# Altium project NFC-Reader.PrjPcb (part 11 of 11)
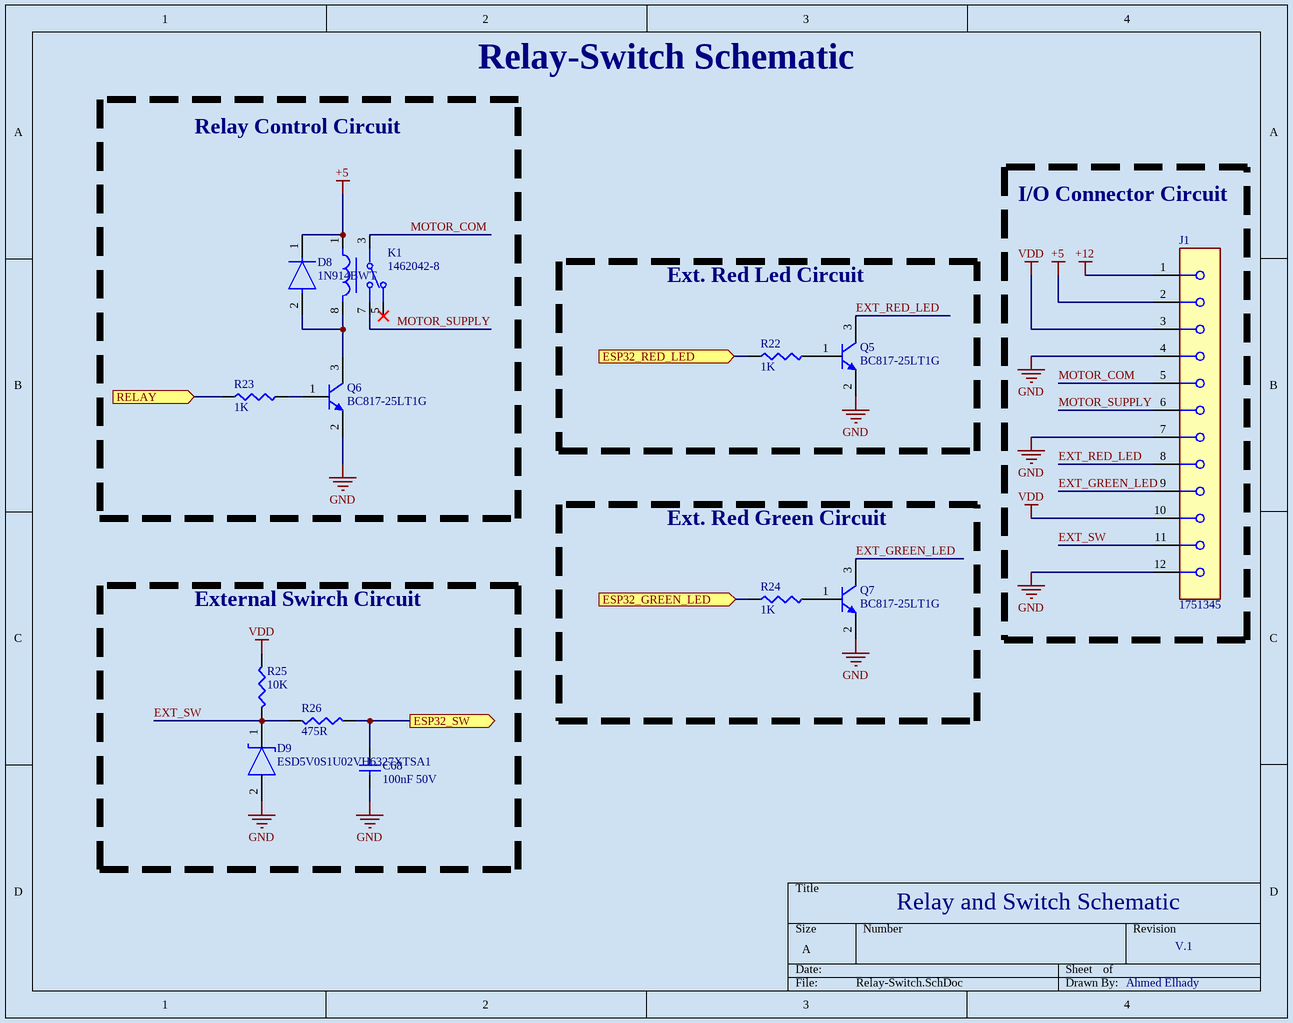
[diagram p13: Relay-Switch.SchDoc]

## Nets that join several sheets
+5: Power Supply (7 pins), Relay-Switch (D8.1 J1.2 K1.1)
+12: Power Supply (14 pins), Relay-Switch (J1.1)
GND: Power Supply (50 pins), ESP32-Main (17 pins), RFID-Reader (36 pins), Relay-Switch (8 pins)
VDD: Power Supply (5 pins), ESP32-Main (11 pins), RFID-Reader (C62.2 C63.2 U2.2 U2.25), Relay-Switch (J1.3 J1.10 R25.2)
ESP32_GREEN_LED: ESP32-Main (U1.17), Relay-Switch (R24.2)
ESP32_RED_LED: ESP32-Main (U1.20), Relay-Switch (R22.2)
ESP32_SW: ESP32-Main (U1.21), Relay-Switch (C68.2 R26.2)
NFC_ENABLE: ESP32-Main (U1.18), RFID-Reader (R20.2 U2.28)
RELAY: ESP32-Main (U1.24), Relay-Switch (R23.2)
RF_IRQ: ESP32-Main (U1.22), RFID-Reader (U2.13)
RF_MISO: ESP32-Main (U1.38), RFID-Reader (U2.23)
RF_MOSI: ESP32-Main (U1.36), RFID-Reader (U2.24)
RF_SPI_CLK: ESP32-Main (U1.35), RFID-Reader (U2.26)
RF_SS: ESP32-Main (U1.34), RFID-Reader (U2.21)
SYS_CLK: ESP32-Main (U1.31), RFID-Reader (U2.27)